# EAGLE design AnalogPSU (EAGLE 7.3.0)
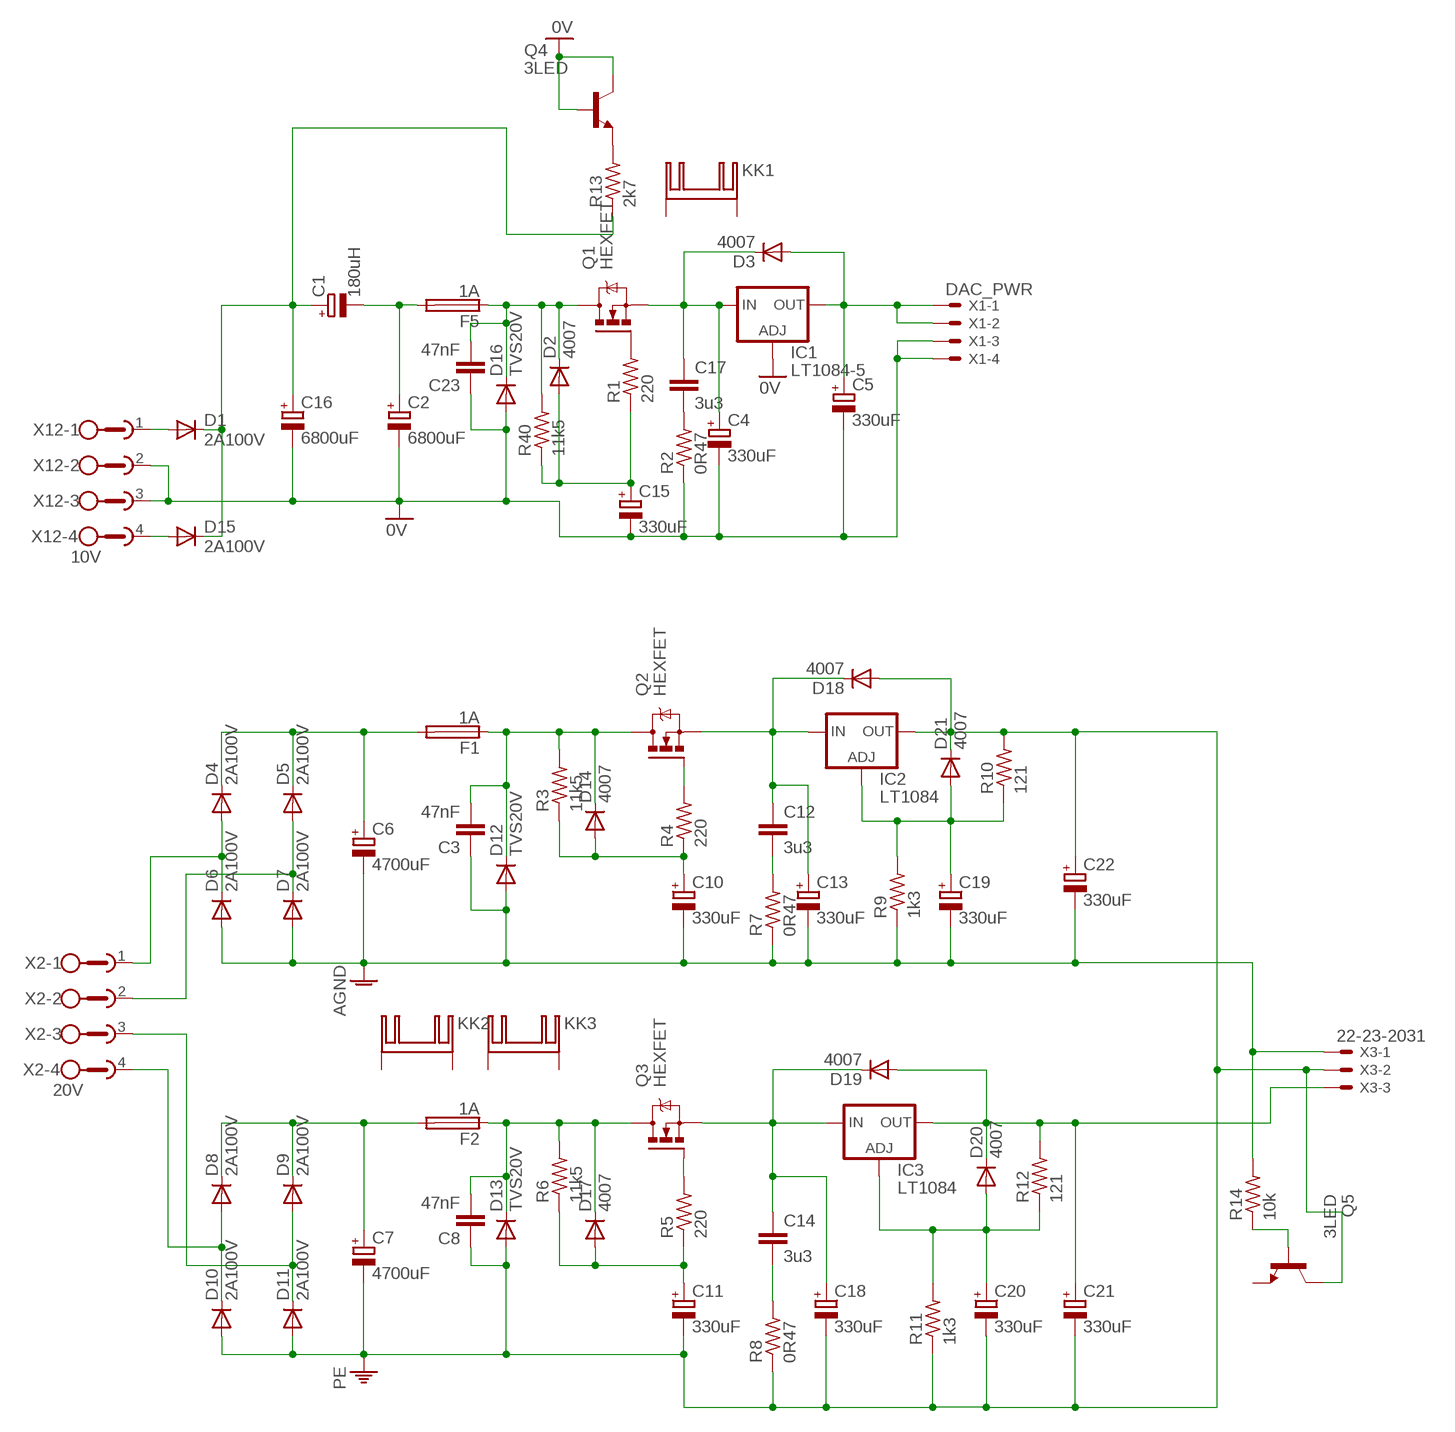
[diagram p0: schematic, sheet 1]

## Parts
C1  180uH  CPOL-EUB45181C  [B45181C]
C2  6800uF  CPOL-EUE10-20  [EB20D]
C3  47nF  C-EU050-075X075  [C050-075X075]
C4  330uF  CPOL-EUE3.5-10  [E3,5-10]
C5  330uF  CPOL-EUE3.5-10  [E3,5-10]
C6  4700uF  CPOL-EUE10-20  [EB20D]
C7  4700uF  CPOL-EUE10-20  [EB20D]
C8  47nF  C-EU050-075X075  [C050-075X075]
C10  330uF  CPOL-EUE3.5-10  [E3,5-10]
C11  330uF  CPOL-EUE3.5-10  [E3,5-10]
C12  3u3  C27/13  [C27.5B13]
C13  330uF  CPOL-EUE3.5-10  [E3,5-10]
C14  3u3  C27/13  [C27.5B13]
C15  330uF  CPOL-EUE3.5-10  [E3,5-10]
C16  6800uF  CPOL-EUE10-20  [EB20D]
C17  3u3  C27/13  [C27.5B13]
C18  330uF  CPOL-EUE3.5-10  [E3,5-10]
C19  330uF  CPOL-EUE3.5-10  [E3,5-10]
C20  330uF  CPOL-EUE3.5-10  [E3,5-10]
C21  330uF  CPOL-EUE3.5-10  [E3,5-10]
C22  330uF  CPOL-EUE3.5-10  [E3,5-10]
C23  47nF  C-EU050-075X075  [C050-075X075]
D1  2A100V  1N4004  [DO41-10]
D2  4007  1N4148DO35-10  [DO35-10]
D3  4007  1N4148DO35-10  [DO35-10]
D4  2A100V  1N4004  [DO41-10]
D5  2A100V  1N4004  [DO41-10]
D6  2A100V  1N4004  [DO41-10]
D7  2A100V  1N4004  [DO41-10]
D8  2A100V  1N4004  [DO41-10]
D9  2A100V  1N4004  [DO41-10]
D10  2A100V  1N4004  [DO41-10]
D11  2A100V  1N4004  [DO41-10]
D12  TVS20V  BY448  [SOD57-10]
D13  TVS20V  BY448  [SOD57-10]
D14  4007  1N4148DO35-10  [DO35-10]
D15  2A100V  1N4004  [DO41-10]
D16  TVS20V  BY448  [SOD57-10]
D17  4007  1N4148DO35-10  [DO35-10]
D18  4007  1N4148DO35-7  [DO35-7]
D19  4007  1N4148DO35-7  [DO35-7]
D20  4007  1N4148DO35-7  [DO35-7]
D21  4007  1N4148DO35-7  [DO35-7]
F1  1A  19560  [19560]
F2  1A  19560  [19560]
F5  1A  19560  [19560]
IC1  LT1084-5  LM317TS  [317TS]
IC2  LT1084  LM317TS  [317TS]
IC3  LT1084  LM317TS  [317TS]
KK1  SK104-PAD  [SK104-PAD]
KK2  SK104-PAD  [SK104-PAD]
KK3  SK104-PAD  [SK104-PAD]
Q1  HEXFET  IRF520  [TO220BV]
Q2  HEXFET  IRF520  [TO220BV]
Q3  HEXFET  IRF520  [TO220BV]
Q4  3LED  BC546A  [TO92-EBC]
Q5  3LED  BC546A  [TO92-EBC]
R1  220  R-US_0309/10  [0309/10]
R2  0R47  R-US_0617/5V  [0617V]
R3  11k5  R-US_0309/10  [0309/10]
R4  220  R-US_0309/10  [0309/10]
R5  220  R-US_0309/10  [0309/10]
R6  11k5  R-US_0309/10  [0309/10]
R7  0R47  R-US_0617/5V  [0617V]
R8  0R47  R-US_0617/5V  [0617V]
R9  1k3  R-US_0309/10  [0309/10]
R10  121  R-US_0309/10  [0309/10]
R11  1k3  R-US_0309/10  [0309/10]
R12  121  R-US_0309/10  [0309/10]
R13  2k7  R-US_0309/12  [0309/12]
R14  10k  R-US_0309/10  [0309/10]
R40  11k5  R-US_0309/10  [0309/10]
X1  DAC_PWR  22-23-2041  [22-23-2041]
X2  20V  GMSTBA4  [GMSTBA4]
X3  22-23-2031  [22-23-2031]
X12  10V  GMSTBA4  [GMSTBA4]

## Nets
0V: C2.- C4.- C5.- C15.- C16.- C23.1 D16.A IC1.1(ADJ) Q4.B Q4.C R2.1 X1.3 X1.4 X12.2 X12.3
AGND: C3.1 C6.- C10.- C13.- C19.- C22.- D6.A D7.A D12.A R7.1 R9.1 R14.2 X3.1
N$1: C17.2 R2.2
N$2: D15.A X12.4
N$3: D1.A X12.1
N$4: C1.+ C16.+ D1.C D15.C R13.1
N$5: C1.- C2.+ F5.2
N$6: C23.2 D2.C D16.C F5.1 Q1.D R40.2
N$7: C8.2 D13.C D17.C F2.1 Q3.D R6.2
N$8: C5.+ D3.A IC1.2(OUT) X1.1 X1.2
N$9: C4.+ C17.1 D3.C IC1.3(IN) Q1.S
N$10: C15.+ D2.A R1.1 R40.1
N$11: Q1.G R1.2
N$12: C6.+ D4.C D5.C F1.2
N$13: C7.+ D8.C D9.C F2.2
N$14: C3.2 D12.C D14.C F1.1 Q2.D R3.2
N$15: D8.A D10.C X2.4
N$16: D9.A D11.C X2.3
N$17: D4.A D6.C X2.1
N$18: D5.A D7.C X2.2
N$19: Q2.G R4.2
N$20: C10.+ D14.A R3.1 R4.1
N$21: C11.+ D17.A R5.1 R6.1
N$22: Q3.G R5.2
N$24: C14.1 C18.+ D19.C IC3.3(IN) Q3.S
N$25: C14.2 R8.2
N$26: C21.+ D19.A D20.C IC3.2(OUT) R12.2 X3.3
N$27: Q4.E R13.2
N$28: C20.+ D20.A IC3.1(ADJ) R11.2 R12.1
N$29: Q5.B R14.1
N$31: C19.+ D21.A IC2.1(ADJ) R9.2 R10.1
N$33: C12.1 C13.+ D18.C IC2.3(IN) Q2.S
N$34: C12.2 R7.2
PE: C7.- C8.1 C11.- C18.- C20.- C21.- C22.+ D10.A D11.A D13.A D18.A D21.C IC2.2(OUT) Q5.C R8.1 R10.2 R11.1 X3.2
Unconnected: KK1.K1(K) KK1.K2(K) KK2.K1(K) KK2.K2(K) KK3.K1(K) KK3.K2(K) Q5.E

## Library data of the parts
C1 C2 C4-C7 C10 C11 C13 C15 C16 C18-C22 = resistor:CPOL-EU: POLARIZED CAPACITOR, European symbol
C3 C8 C23 = resistor:C-EU: CAPACITOR, European symbol
C12 C14 C17 = capacitor-wima:C: CAPACITOR naming: grid - package width
D1 D4-D11 D15 = diode:1N4004: DIODE general purpose rectifier, 1 A
D2 D3 D14 D17-D21 = diode:1N4148: DIODE high speed (Philips)
D12 D13 D16 = diode:BY448: DIODE damper diode
F1 F2 F5 = fuse:19560: FUSE HOLDER TR5, Wickmann; MPN: 56000001009; OC_FARNELL: 1185363; OC_NEWARK: 15P8392
IC1-IC3 = v-reg:LM317TS: VOLTAGE REGULATOR
KK1-KK3 = heatsink:SK104-PAD: HEATSINK manufacturer Fischer/distributor Buerklin
Q1-Q3 = transistor-power:IRF520: HEXFET Power MOSFET
Q4 Q5 = transistor-npn:BC546*: NPN Transistor
R1-R14 R40 = resistor:R-US_: RESISTOR, American symbol
X1 = con-molex:22-23-2041: .100" (2.54mm) Center Header - 4 Pin; MF: MOLEX; MPN: 22-23-2041; OC_FARNELL: 1462920; OC_NEWARK: 38C0355
X2 X12 = con-phoenix-762:GMSTBA4: PHOENIX; MF: FARNELL; MPN: 1757268; OC_FARNELL: 3705195; OC_NEWARK: 71C4163
X3 = con-molex:22-23-2031: .100" (2.54mm) Center Header - 3 Pin; MF: MOLEX; MPN: 22-23-2031; OC_FARNELL: 1462950; OC_NEWARK: 30C0862

## Board
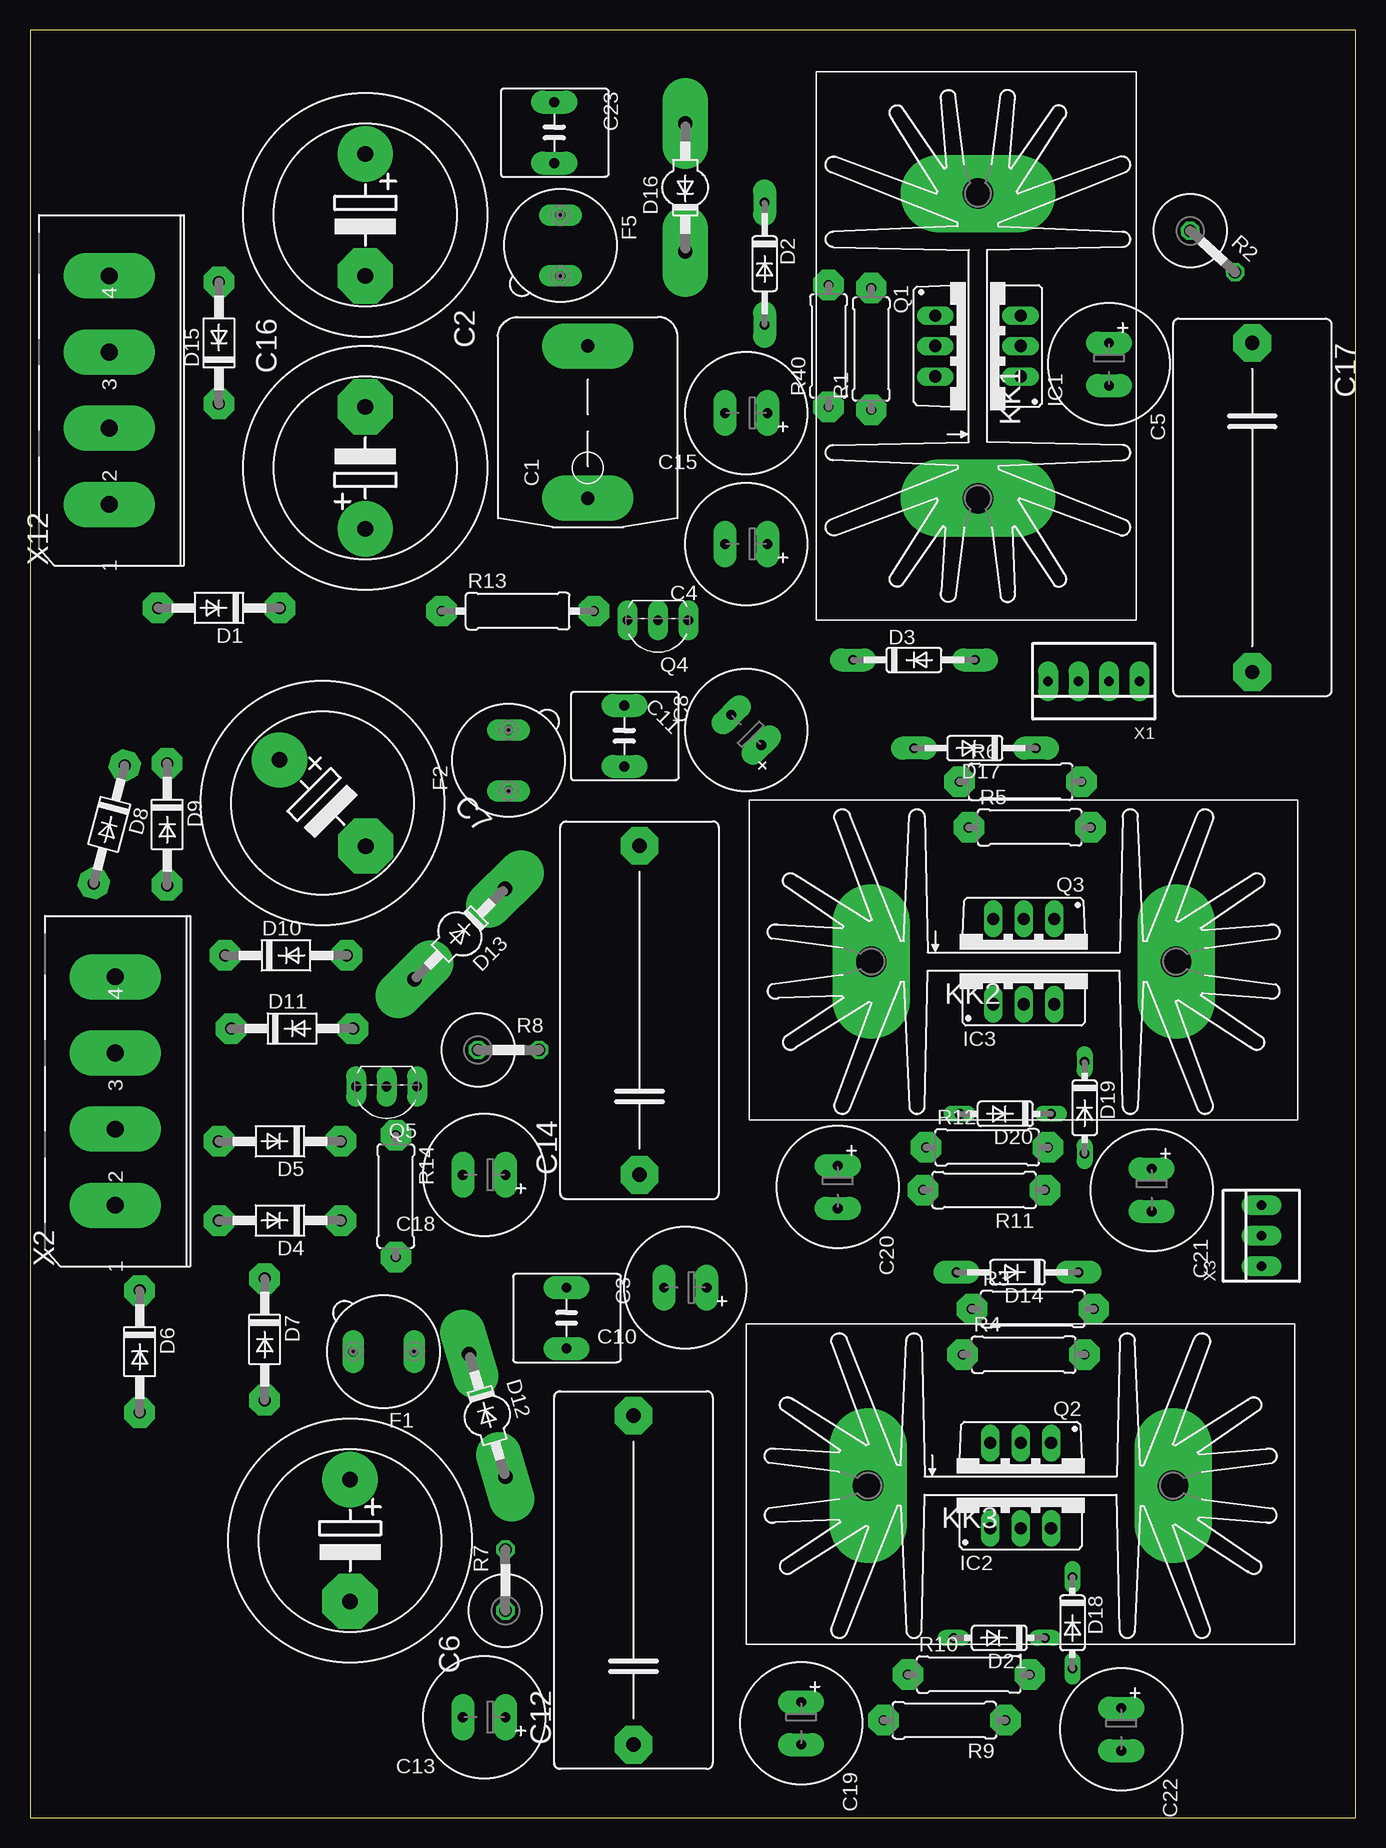
[diagram p1: board, top side]
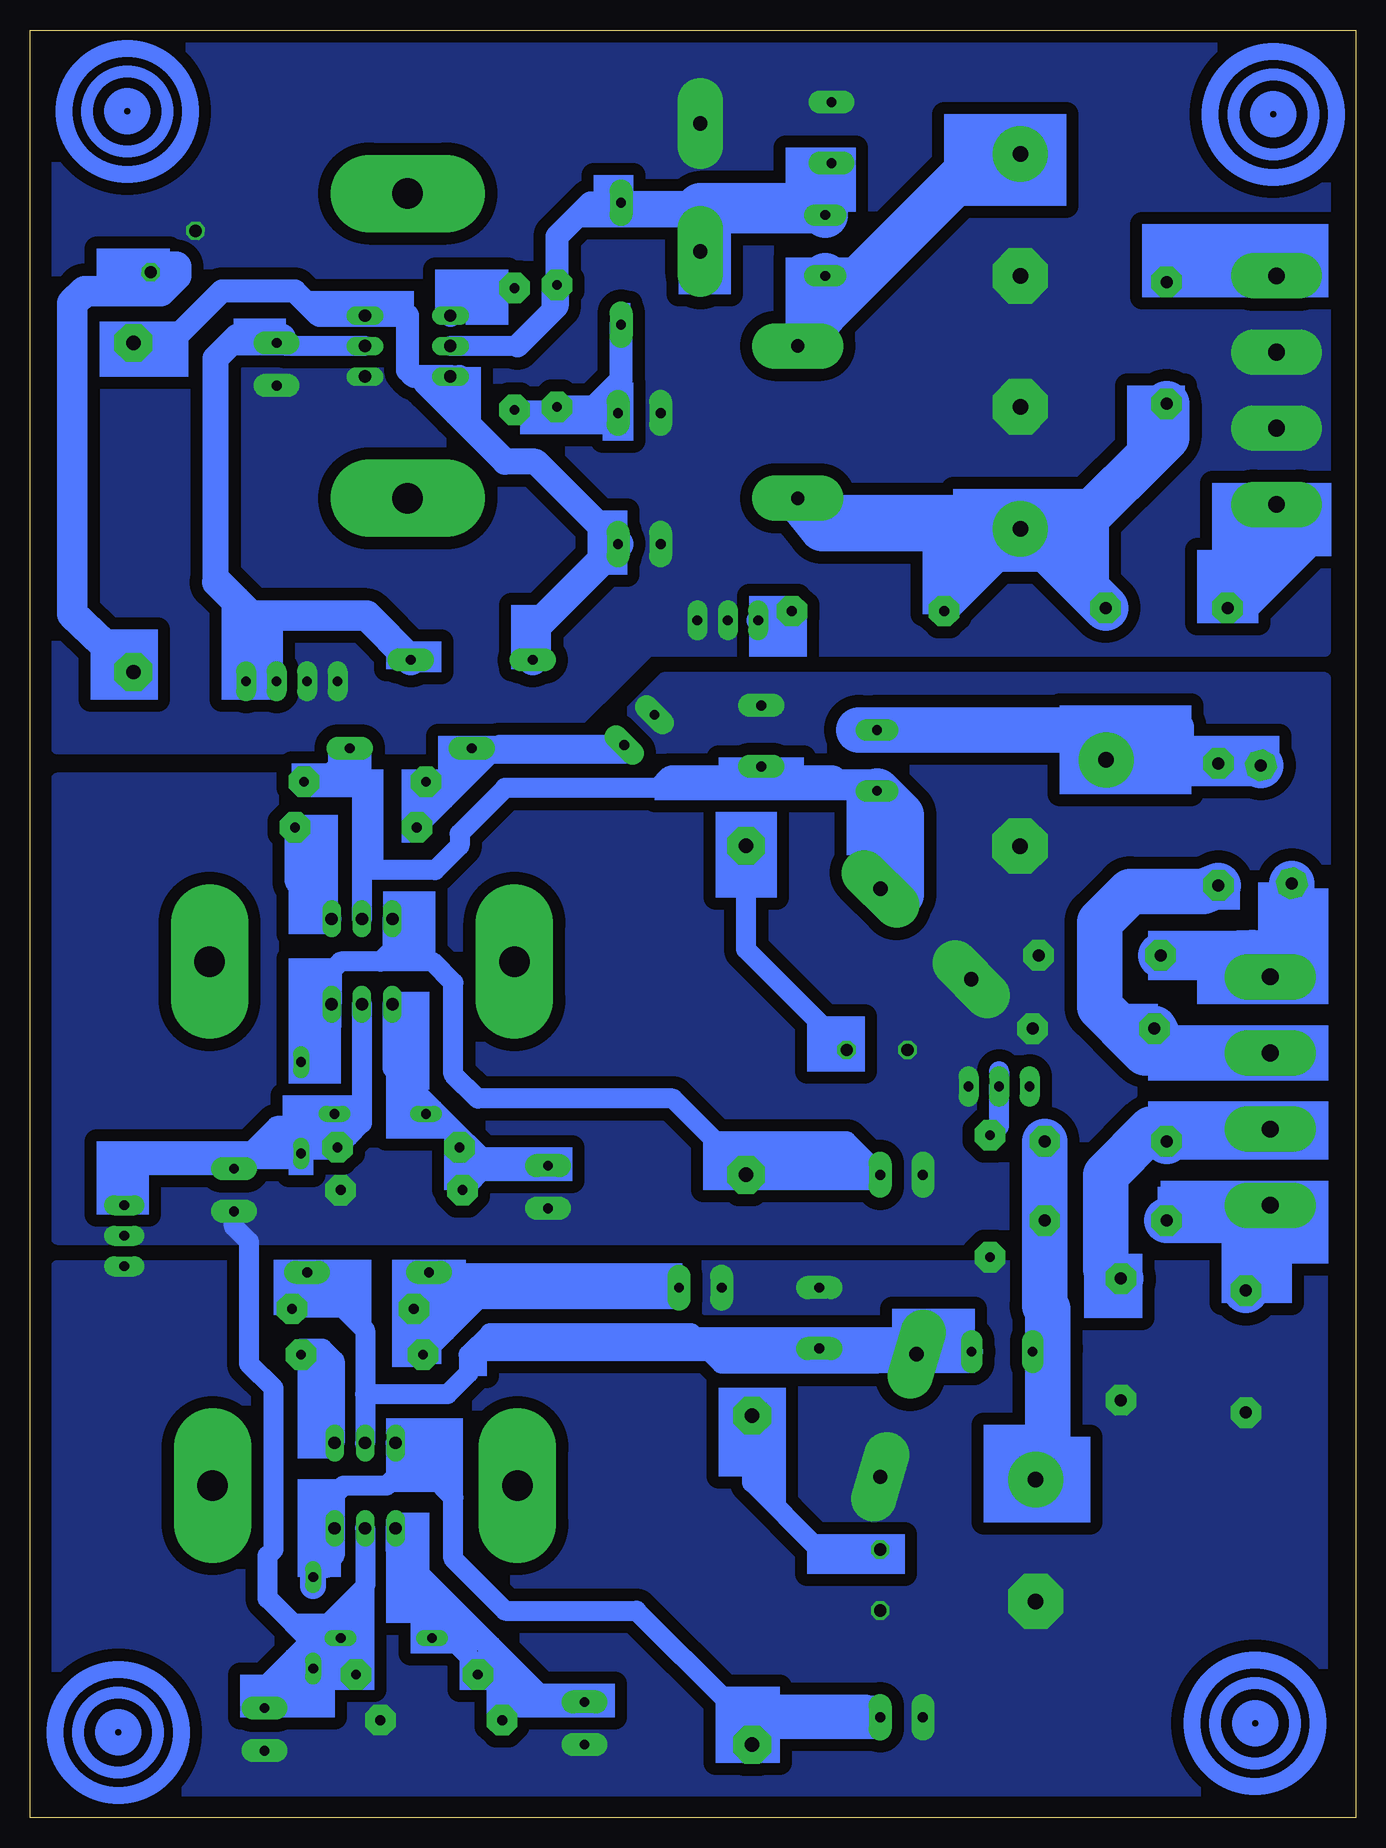
[diagram p2: board, bottom side, seen from below]

Size 110.47 x 149.02 mm. Coordinates in mm from the lower left corner, seen from the top.
Outline: 0,0 110.47,0 110.47,149.02 0,149.02 0,0
Copper layers (1*16): Top 0.035mm / dielectric 1.5mm / Bottom 0.035mm
Design rules "default": minimum track width 10mil, minimum drill 24mil, track to track 8mil, track to pad 8mil, pad to pad 8mil, via to via 8mil, smd to smd 8mil, copper to edge 40mil, drill to drill 8mil, minimum pad ring 10mil, minimum via ring 8mil, stop-mask expansion 4mil, vias tented up to drill 0mil, thermal gap 10mil

### Footprints (pad centres in the part's own frame; a part is rotated, then mirrored left to right if it is on the bottom)
B45181C = drill 1.1 pad 3.81 long: + -6.35,0; - 6.35,0
EB20D = drill 1.3 pad 4.597: + -5.08,0 | drill 1.3 pad 4.597 octagon: - 5.08,0
C050-075X075 = drill 0.813 pad 1.93 long: 1 -2.54,0; 2 2.54,0
E3,5-10 = drill 0.813 pad 1.93 long: + -1.778,0; - 1.778,0
C27.5B13 = drill 1.194 pad 3.15 octagon: 1 -13.716,0; 2 13.716,0
DO41-10 = drill 1 pad 2.54 octagon: A 5.08,0; C -5.08,0
DO35-10 = drill 0.813 pad 1.93 long: A 5.08,0; C -5.08,0
SOD57-10 = drill 1.194 pad 3.81 long: A 5.334,0; C -5.334,0
DO35-7 = drill 0.813 long: A 3.81,0; C -3.81,0
19560 = drill 0.813 pad 1.778 long: 1 -2.54,0; 2 2.54,0
317TS = drill 1.016 long: 1 -2.54,-2.54; 2 0,-2.54; 3 2.54,-2.54
SK104-PAD = drill 2.54 pad 6.452 long: K1 -12.7,-0.762; K2 12.7,-0.762
TO220BV = drill 1.016 long: D 0,-2.54; G -2.54,-2.54; S 2.54,-2.54
TO92-EBC = drill 0.813 pad 1.676 long: B 0,-1.27; C -2.54,-1.27; E 2.54,-1.27
0309/10 = drill 0.813 pad 2.54 octagon: 1 -5.08,0; 2 5.08,0
0617V = drill 1.016 octagon: 1 -2.54,0; 2 2.54,0
0309/12 = drill 0.813 pad 2.54 octagon: 1 -6.35,0; 2 6.35,0
22-23-2041 = drill 0.8 pad 1.676 long: 1 -3.81,0; 2 -1.27,0; 3 1.27,0; 4 3.81,0
GMSTBA4 = drill 1.397 pad 3.81 long: 1 -8.89,5.08; 2 -2.54,5.08; 3 3.81,5.08; 4 10.16,5.08
22-23-2031 = drill 0.8 pad 1.676 long: 1 -2.54,0; 2 0,0; 3 2.54,0

### Placement (x,y rotation side)
C1  46.48,116.33 90 top
C2  27.94,133.6 270 top
C3  44.7,41.66 270 top
C4  59.69,106.17 180 top
C5  89.92,121.16 270 top
C6  26.67,23.11 270 top
C7  24.38,84.58 315 top
C8  49.53,90.17 270 top
C10  54.61,44.2 180 top
C11  59.69,90.68 135 top
C12  50.29,19.81 90 top
C13  37.85,8.38 180 top
C14  50.8,67.31 90 top
C15  59.69,117.09 180 top
C16  27.94,112.52 90 top
C17  101.85,109.22 270 top
C18  37.85,53.59 180 top
C19  64.26,7.87 270 top
C20  67.31,52.58 270 top
C21  93.47,52.32 270 top
C22  90.93,7.37 270 top
C23  43.69,140.46 270 top
D1  15.75,100.84 180 top
D2  61.21,129.54 270 top
D3  73.66,96.52 0 top
D4  20.83,49.78 180 top
D5  20.83,56.39 180 top
D6  9.14,38.86 270 top
D7  19.56,39.88 270 top
D8  6.6,82.8 255.3 top
D9  11.43,82.8 270 top
D10  21.34,71.88 0 top
D11  21.84,65.79 0 top
D12  38.1,33.53 286.5 top
D13  35.81,73.66 224.9 top
D14  82.3,45.47 180 top
D15  15.75,122.94 90 top
D16  54.61,135.89 90 top
D17  78.74,89.15 180 top
D18  86.87,16.26 270 top
D19  87.88,59.18 270 top
D20  81.28,58.67 180 top
D21  80.77,14.99 180 top
F1  29.46,38.86 180 top
F2  39.88,88.14 90 top
F5  44.2,131.06 270 top
IC1  80.01,122.68 90 top
IC2  82.55,26.67 0 top
IC3  82.8,70.36 0 top
KK1  78.23,122.68 90 top
KK2  82.8,72.14 0 top
KK3  82.55,28.45 0 top
Q1  77.98,122.68 270 top
Q2  82.55,28.7 180 top
Q3  82.8,72.39 180 top
Q4  52.32,98.55 180 top
Q5  29.72,59.69 180 top
R1  70.1,122.43 90 top
R2  98.55,130.56 317.3 top
R3  83.57,42.42 0 top
R4  82.8,38.61 0 top
R5  83.31,82.55 0 top
R6  82.55,86.36 0 top
R7  39.62,19.81 90 top
R8  39.88,64.01 0 top
R9  76.2,8.13 180 top
R10  78.23,11.94 0 top
R11  79.5,52.32 180 top
R12  79.76,55.88 0 top
R13  40.64,100.58 0 top
R14  30.48,51.82 270 top
R40  66.55,122.68 90 top
X1  88.65,94.74 180 top
X2  12.19,59.94 90 top
X3  102.62,48.51 90 top
X12  11.68,118.36 90 top

### Tracks (layer width: path | path; a pad name or v marks a point on that pad's centre or on a via)
0V
  pour Bottom (isolate 1.016, no thermals): 108.2,89.15 67.06,89.15 58.93,97.28 2.54,97.28 2.54,147.83 108.2,147.83
AGND
  pour Bottom (isolate 1.016, no thermals): 108.2,2.29 2.79,2.29 2.79,45.97 108.2,45.97
N$1
  Bottom 2.54: C17.2 106.93,100.33 106.93,126.24 105.92,127.25 99.57,127.25 98.3,128.52 98.3,129.29 102.62,129.29 102.56,128.83 R2.2
N$2
  Bottom 2.184: X12.4 15.75,128.52 D15.A
N$3
  Bottom 2.184: D1.A 8.89,101.09 4.06,105.92 4.06,107.44 X12.1
N$4
  Bottom 1.93: R13.1 34.04,100.58 27.18,107.44
  Bottom 3.81: D15.C 15.75,115.06 23.37,107.44 27.18,107.44 27.43,107.44 | D1.C 27.43,107.44 | 27.43,107.44 C16.+ 44.45,107.44 C1.+
N$5
  Bottom 3.81: C1.- 44.2,125.48 | 44.2,125.48 30.99,138.68 C2.+ | F5.2 44.2,125.48
N$6
  Bottom 1.676: C23.2 43.69,134.11 F5.1 | 69.85,122.68 Q1.D
  Bottom 1.93: 69.85,122.68 66.55,125.98 R40.2 66.55,131.83 63.75,134.62 D2.C 54.86,134.62 54.61,134.37
  Bottom 3.81: F5.1 44.96,134.37 54.61,134.37 D16.C
N$7
  Bottom 1.676: R6.2 86.11,86.36 | 86.11,86.36 82.8,86.36 82.8,78.99 | 82.8,78.99 Q3.D | 86.11,86.36 83.82,88.65 D17.C | F2.1 42.16,85.6 43.43,86.87 49.53,86.87 | 49.53,86.87 57.15,86.87 58.17,85.85 70.87,85.85 74.68,82.04 74.68,81.03 76.71,78.99 82.8,78.99 | C8.2 49.53,86.87
  Bottom 3.81: F2.1 37.85,83.57 37.85,76.96 39.07,78.19 D13.C
N$8
  Bottom 1.676: 89.41,123.44 88.39,122.68 88.9,122.68 89.15,122.94 C5.+ | X1.2 91.19,94.49 X1.1 | IC1.2 89.15,122.68 89.92,123.44
  Bottom 2.184: 91.95,100.08 92.08,100.2 | 94.87,103 95,103.12 95,121.67 93.22,123.44 89.92,123.44 89.41,123.44
  Bottom 2.54: 91.19,94.49 91.19,99.82 92.08,100.2 | 92.08,100.2 94.87,103 | D3.A 82.42,100.2 92.08,100.2
N$9
  Bottom 1.676: 78.49,120.14 77.98,120.14 77.09,119.25
  Bottom 1.93: 74.68,120.14 Q1.S 78.49,120.14 78.99,120.65 78.99,125.22 IC1.3 86.36,125.22 88.39,127.25 94.49,127.25 99.06,122.68 101.85,122.68 C17.1 | C4.+ 62.61,106.17 62.61,107.31
  Bottom 2.184: 62.61,107.31 68.33,113.03 70.87,113.03 77.09,119.25 77.47,119.63
  Bottom 2.54: D3.C 68.58,99.06 C4.+
N$10
  Bottom 1.676: R1.1 66.8,117.35 R40.1
  Bottom 1.93: C15.+ 62.23,117.6 63.5,117.6 | 63.5,117.6 R40.1 | 63.5,117.6 61.21,119.89 D2.A
N$11
  Bottom 1.93: Q1.G 72.9,127.76 R1.2
N$12
  Bottom 1.778: 26.42,39.12 26.67,38.86 F1.2
  Bottom 2.54: 26.42,39.12 25.65,39.12
  Bottom 3.81: D5.C D4.C 25.91,42.67 25.65,42.42 25.65,39.12 25.65,29.21 C6.+
N$13
  Bottom 2.54: 14.73,90.93 14.73,87.88
  Bottom 3.81: D8.C 8.06,87.88 D9.C 14.73,87.88 18.54,87.88 18.76,87.67 C7.+ 23.3,90.68 F2.2 41.4,90.68
N$14
  Bottom 1.676: 38.86,38.86 39.88,37.85 44.96,37.85 | 44.96,37.85 52.83,37.85 55.37,40.39 72.14,40.39 73.91,38.61 73.91,37.08 75.69,35.31 82.55,35.31 | 82.55,35.31 Q2.D | D14.C 84.46,42.54 | 84.46,42.54 82.55,40.64 82.55,35.31 | R3.2 88.52,42.54 84.46,42.54 | C3.2 44.7,38.1 44.96,37.85
  Bottom 1.93: F1.1 38.86,38.86 D12.C
N$15
  Bottom 3.81: 5.08,71.63 5.33,71.37 | 5.33,71.37 X2.4 8.64,72.14 D10.C | D8.A 5.33,77.87 5.33,71.37
N$16
  Bottom 3.81: X2.3 16.26,63.75 D11.C | D11.C 16.26,64.26 16,64.01 16.51,64.01 16.76,63.75 17.53,63.75 18.29,64.52 | D11.C 16.26,64.77 16.51,64.52 18.29,64.52 | 18.29,64.52 21.34,67.56 21.34,74.68 18.8,77.22 12.7,77.22 D9.A
N$17
  Bottom 3.81: D4.A 6.6,49.78 | 6.6,49.78 D6.C | X2.1 8.13,49.53 6.6,49.78
N$18
  Bottom 3.81: D5.A 14.73,57.4 | 14.73,57.4 X2.2 | D7.C 20.83,45.72 20.83,53.59 17.02,57.4 14.73,57.4
N$19
  Bottom 1.676: R4.2 87.88,39.12 86.11,39.12 85.09,38.1 Q2.G
N$20
  Bottom 1.676: R4.1 75.82,40.51 | 75.82,40.51 73.79,42.54 | 73.79,42.54 72.14,44.2 C10.+ | D14.A 74.3,42.54 73.79,42.54 | R3.1 76.58,40.51 75.82,40.51
N$21
  Bottom 1.676: C11.+ 71.36,89.42 72.01,88.77 | 73.66,88.39 D17.A 72.39,89.15 72.01,88.77 | 72.01,88.77 75.95,84.84 | 75.95,84.84 R5.1 | R6.1 75.95,84.84
N$22
  Bottom 1.676: Q3.G 88.39,77.98 R5.2
N$24
  Bottom 1.676: Q3.S 80.26,72.39 81.28,71.37 | 81.28,71.37 84.58,71.37 85.34,70.61 IC3.3 85.34,66.04 D19.C | C14.1 53.34,56.39 | 53.34,56.39 56.9,59.94 73.15,59.94 75.18,61.98 75.18,69.6 76.96,71.37 81.28,71.37 | C18.+ 42.42,56.39 53.34,56.39
N$25
  Bottom 1.676: R8.2 50.8,72.39 C14.2
N$26
  Bottom 1.676: IC3.2 82.8,57.91 83.95,56.77 | 83.95,56.77 R12.2 84.84,56.64 85.85,57.66 87.88,57.66 | D20.C 85.09,57.91 83.95,56.77 | 87.88,57.66 89.92,57.66 92.46,55.12 | 92.46,55.12 C21.+ | D19.A 87.88,57.66 | X3.3 102.62,54.1 101.6,55.12 92.46,55.12
N$27
  Bottom 1.93: Q4.E 47.75,99.82 R13.2
N$28
  Bottom 1.676: IC3.1 80.26,62.48 76.84,59.05 | 76.84,59.05 74.04,56.26 | 74.04,56.26 72.14,54.36 | 72.14,54.36 C20.+ | R11.2 72.39,54.36 72.14,54.36 | R12.1 74.68,55.63 74.04,56.26 | D20.A 76.84,59.05
N$29
  Bottom 1.676: R14.1 29.72,57.66 Q5.B 29.72,62.23
N$31
  Bottom 1.676: C19.+ 67.31,9.65 72.01,14.35 | 72.01,14.35 80.01,22.35 IC2.1 | R9.2 71.12,10.67 73.28,12.83 | 73.28,12.83 75.44,14.99 D21.A | 72.01,14.35 R10.1 73.15,12.19 73.28,12.83
N$33
  Bottom 1.676: Q2.S 80.01,28.45 | 80.01,28.45 80.77,27.69 84.33,27.69 85.09,26.92 IC2.3 85.09,22.35 | C13.+ 40.64,9.4 50.29,9.4 | 50.29,9.4 52.07,9.4 59.94,17.27 70.87,17.27 75.18,21.59 75.18,26.67 76.96,28.45 80.01,28.45 | C12.1 50.29,9.4 | 85.09,22.35 85.09,21.84 | 85.85,22.35 85.09,22.35
  Bottom 2.184: 85.85,22.35 85.85,21.08 86.87,21.08 D18.C 86.87,19.3
N$34
  Bottom 1.676: R7.2 44.7,22.35 50.29,27.94 C12.2
PE
  Bottom 1.676: IC2.2 82.55,19.3 88.52,13.33 | 88.52,13.33 91.44,10.41 C22.+ | R10.2 83.82,12.45 84.07,12.45 | 84.07,12.45 D18.A | D21.C 84.07,12.45 | D21.C 84.84,14.22 86.61,14.22 90.68,18.29 90.68,21.84 90.17,22.35 90.17,35.81 92.2,37.85 92.2,48.01 93.47,49.28 C21.- | D21.C 85.73,13.33 88.52,13.33
  pour Bottom (isolate 1.016, no thermals): 2.54,95 57.66,95 66.04,86.61 108.2,86.61 108.2,48.26 27.94,48.26 18.54,51.56 18.54,48.77 2.54,48.77
(copper drawn outside any net)
  shapes: Bottom area x265, Bottom circle x12